# EAGLE schematic plan (EAGLE 6.2)
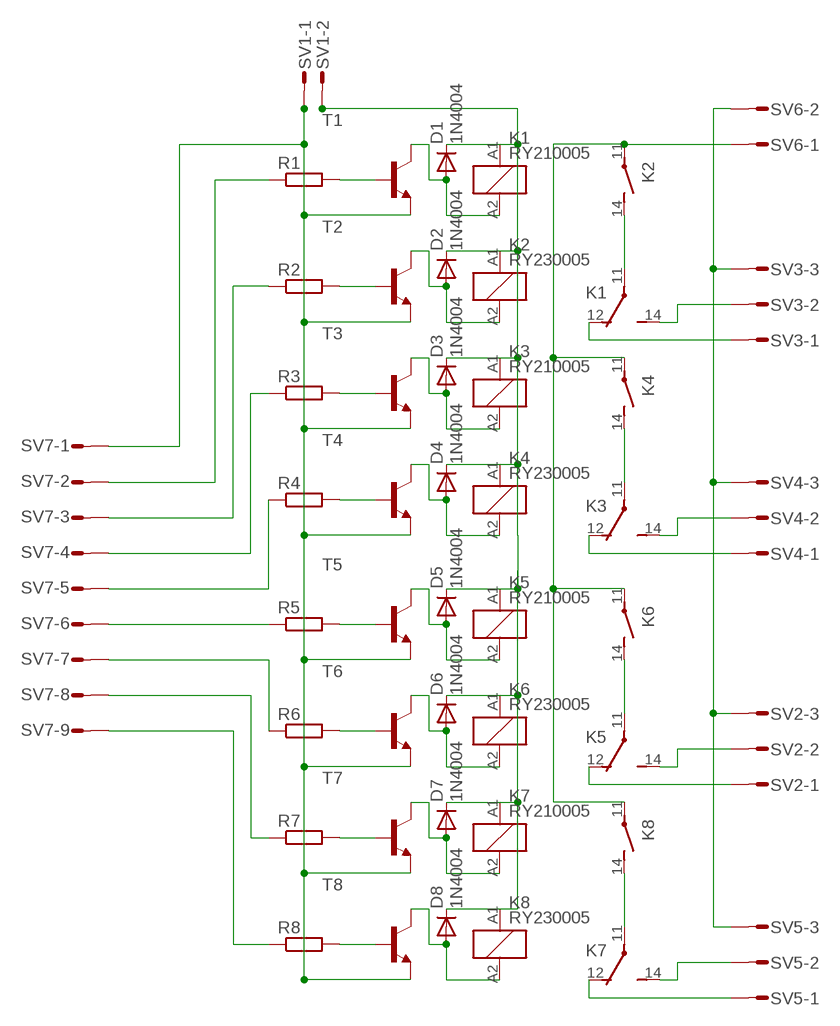
[diagram p0: schematic, sheet 1]

## Parts
D1  1N4004  [DO41-10]
D2  1N4004  [DO41-10]
D3  1N4004  [DO41-10]
D4  1N4004  [DO41-10]
D5  1N4004  [DO41-10]
D6  1N4004  [DO41-10]
D7  1N4004  [DO41-10]
D8  1N4004  [DO41-10]
K1  RY210005  [RY-II]
K2  RY230005  [RY-II1]
K3  RY210005  [RY-II]
K4  RY230005  [RY-II1]
K5  RY210005  [RY-II]
K6  RY230005  [RY-II1]
K7  RY210005  [RY-II]
K8  RY230005  [RY-II1]
R1  R-EU_0207/7  [0207/7]
R2  R-EU_0207/7  [0207/7]
R3  R-EU_0207/7  [0207/7]
R4  R-EU_0207/7  [0207/7]
R5  R-EU_0207/7  [0207/7]
R6  R-EU_0207/7  [0207/7]
R7  R-EU_0207/7  [0207/7]
R8  R-EU_0207/7  [0207/7]
SV1  L02P  [L02P]
SV2  L03P  [L03P]
SV3  L03P  [L03P]
SV4  L03P  [L03P]
SV5  L03P  [L03P]
SV6  L02P  [L02P]
SV7  L09P  [L09P]
T1  -NPN-TO92  [TO92]
T2  -NPN-TO92  [TO92]
T3  -NPN-TO92  [TO92]
T4  -NPN-TO92  [TO92]
T5  -NPN-TO92  [TO92]
T6  -NPN-TO92  [TO92]
T7  -NPN-TO92  [TO92]
T8  -NPN-TO92  [TO92]

## Nets
N$1: R1.2 T1.2(B)
N$2: R2.2 T2.2(B)
N$3: SV1.1 SV7.1 T1.1(E) T2.1(E)
N$4: R3.2 T3.2(B)
N$5: D1.A K1.A2 T1.3(C)
N$6: D2.A K2.A2 T2.3(C)
N$7: D1.C D2.C K1.A1 K2.A1 SV1.2
N$8: R4.2 T4.2(B)
N$9: K1.11(2:P) K2.14(2:S)
N$10: SV2.3 SV3.3 SV4.3 SV5.3 SV6.2
N$11: D3.A K3.A2 T3.3(C)
N$12: D4.A K4.A2 T4.3(C)
N$13: D3.C D4.C K3.A1 K4.A1
N$14: K3.11(2:P) K4.14(2:S)
N$15: K3.14(2:S) SV4.2
N$16: K3.12(2:O) SV4.1
N$17: K1.14(2:S) SV3.2
N$18: K1.12(2:O) SV3.1
N$19: K2.11(2:P) K4.11(2:P) K6.11(2:P) K8.11(2:P) SV6.1
N$20: R1.1 SV7.2
N$21: R5.2 T5.2(B)
N$22: R6.2 T6.2(B)
N$23: T3.1(E) T4.1(E) T5.1(E) T6.1(E)
N$24: D5.A K5.A2 T5.3(C)
N$25: D6.A K6.A2 T6.3(C)
N$26: D5.C D6.C K5.A1 K6.A1
N$27: K5.11(2:P) K6.14(2:S)
N$28: R7.2 T7.2(B)
N$29: R8.2 T8.2(B)
N$30: T7.1(E) T8.1(E)
N$31: D7.A K7.A2 T7.3(C)
N$32: D8.A K8.A2 T8.3(C)
N$33: D7.C D8.C K7.A1 K8.A1
N$34: K7.11(2:P) K8.14(2:S)
N$35: K7.14(2:S) SV5.2
N$36: K7.12(2:O) SV5.1
N$37: K5.14(2:S) SV2.2
N$38: K5.12(2:O) SV2.1
N$39: R8.1 SV7.9
N$40: R6.1 SV7.7
N$41: R5.1 SV7.6
N$42: R4.1 SV7.5
N$43: R3.1 SV7.4
N$44: R2.1 SV7.3
N$45: R7.1 SV7.8

## Library data of the parts
D1-D8 = diode:1N4004: DIODE general purpose rectifier, 1 A
K1 K3 K5 K7 = relay:RY?1*: Miniature Power PCB Relay SCHRACK 1 pole 8 A Source: http://www.schrack.com/.. 5817.pdf; MF: TYCO ELECTRONICS; MPN: RY210005; OC_FARNELL: unknown; OC_NEWARK: 08H3762
K2 K4 K6 K8 = relay:RY?3*: Miniature Power PCB Relay SCHRACK 1 pole 8 A Source: http://www.schrack.com/.. 5817.pdf; OC_FARNELL: unknown; OC_NEWARK: unknown
R1-R8 = resistor:R-EU_: RESISTOR, European symbol
SV1 SV6 = con-amp-mt:L02P: AMP MT CONNECTOR; OC_FARNELL: unknown; OC_NEWARK: unknown
SV2-SV5 = con-amp-mt:L03P: AMP MT CONNECTOR; OC_FARNELL: unknown; OC_NEWARK: unknown
SV7 = con-amp-mt:L09P: AMP MT CONNECTOR; OC_FARNELL: unknown; OC_NEWARK: unknown
T1-T8 = transistor:*-NPN-: NPN Transistror BF959 corrected 2008.03.06